# Altium schematic sheet obc_flash.SchDoc
size A4
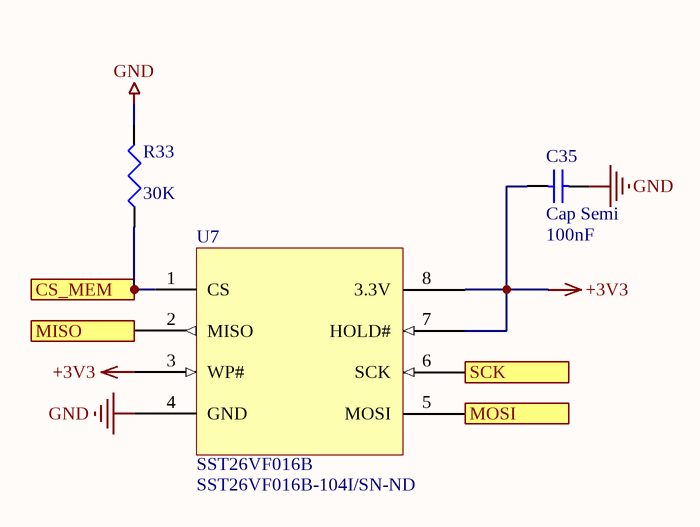
[diagram p0: obc_flash.SchDoc]

## Parts
C35  Cap Semi  value 100nF  [1608[0603]]
R33  value 30K  [J1-0603]
U7  SST26VF016B  Supplier Part Number 1: SST26VF016B-104I/SN-ND  [SOIC127P500X600-8N]

## Ports
CS_MEM (in), MISO (out), MOSI (in), SCK (in)

## Nets
+3V3: C35.1 U7.3(WP#) U7.7(HOLD#) U7.8(3.3V)
GND: C35.2 R33.2 U7.4(GND)
CS_MEM: R33.1 U7.1(CS) ; port CS_MEM
MISO: U7.2(MISO) ; port MISO
MOSI: U7.5(MOSI) ; port MOSI
SCK: U7.6(SCK) ; port SCK

## Library data of the parts
C35 = Cap Semi: Capacitor (Semiconductor SIM Model); Published: 8-Jun-2000; LatestRevisionDate: 29-May-2009; LatestRevisionNote: IPC-7351 Footprint Added.; PackageReference: C1206; Publisher: Altium Limited; PackageDescription: Chip Capacitor
R33 = Res3: 30K Pull-up resistor for RST. See page; Published: 8-Jun-2000; LatestRevisionDate: 29-May-2009; LatestRevisionNote: IPC-7351 Footprint Added.; PackageReference: J1-0603; Publisher: Altium Limited; PackageDescription: Chip Resistor
U7 = SST26VF016B: 2.5V/3.0V 16 Mbit Serial Quad I/O (SQI) Flash Memory; ComponentLink1Description: SST25VF016B; ComponentLink1URL: https://www.digikey.ca/product-detail/en/microchip-technology/SST26VF016B-104I-SN/SST26VF016B-104I-SN-ND/5033651; Supplier 1: Digi-Key